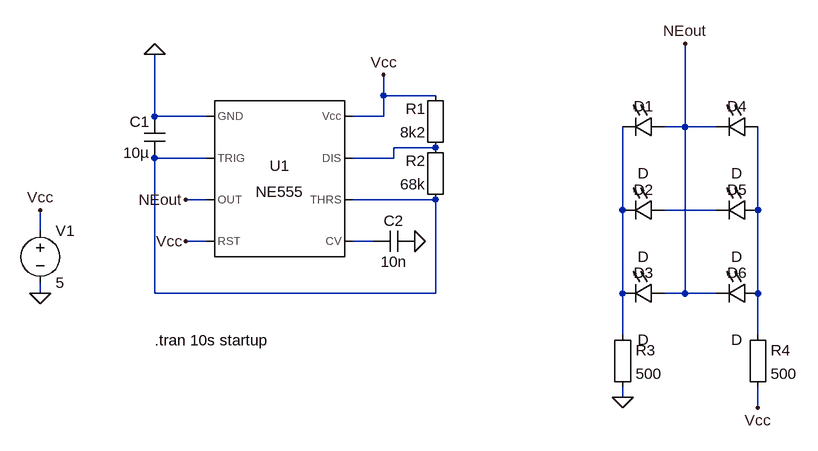
[diagram p0: schematic projekt1.asc]
projekt1.asc, the LTspice schematic file:
Version 4.1
SHEET 1 1160 680
WIRE 464 112 464 80
WIRE 544 112 464 112
WIRE 112 144 112 48
WIRE 192 144 112 144
WIRE 464 144 464 112
WIRE 464 144 416 144
WIRE 928 160 928 32
WIRE 928 160 896 160
WIRE 976 160 928 160
WIRE 544 192 480 192
WIRE 192 208 112 208
WIRE 480 208 480 192
WIRE 480 208 416 208
WIRE 192 272 160 272
WIRE 544 272 416 272
WIRE 832 288 832 160
WIRE 976 288 896 288
WIRE 1040 288 1040 160
WIRE -64 320 -64 288
WIRE 192 336 160 336
WIRE 448 336 416 336
WIRE -64 416 -64 400
WIRE 112 416 112 208
WIRE 544 416 544 272
WIRE 544 416 112 416
WIRE 832 416 832 288
WIRE 928 416 928 160
WIRE 928 416 896 416
WIRE 976 416 928 416
WIRE 1040 416 1040 288
WIRE 832 480 832 416
WIRE 1040 480 1040 416
WIRE 832 576 832 560
WIRE 1040 592 1040 560
FLAG 112 48 0
FLAG -64 416 0
FLAG -64 288 Vcc
FLAG 160 336 Vcc
FLAG 160 272 NEout
FLAG 464 80 Vcc
FLAG 928 32 NEout
FLAG 832 576 0
FLAG 1040 592 Vcc
FLAG 512 336 0
SYMBOL Misc\\NE555 304 240 R0
SYMATTR InstName U1
SYMBOL cap 128 208 R180
WINDOW 0 24 56 Left 2
WINDOW 3 24 8 Left 2
SYMATTR InstName C1
SYMATTR Value 10µ
SYMBOL voltage -64 304 R0
WINDOW 123 0 0 Left 0
WINDOW 39 0 0 Left 0
SYMATTR InstName V1
SYMATTR Value 5
SYMBOL Misc\\EuropeanResistor 560 208 R180
WINDOW 0 31 76 Left 2
WINDOW 3 31 40 Left 2
SYMATTR InstName R1
SYMATTR Value 8k2
SYMATTR SpiceLine tol=100k
SYMBOL Misc\\EuropeanResistor 560 288 R180
WINDOW 0 31 76 Left 2
WINDOW 3 31 40 Left 2
SYMATTR InstName R2
SYMATTR Value 68k
SYMBOL LED 896 144 R90
WINDOW 0 0 32 VBottom 2
WINDOW 3 72 32 VTop 2
SYMATTR InstName D1
SYMBOL LED 896 272 R90
WINDOW 0 0 32 VBottom 2
WINDOW 3 72 32 VTop 2
SYMATTR InstName D2
SYMBOL LED 896 400 R90
WINDOW 0 0 32 VBottom 2
WINDOW 3 72 32 VTop 2
SYMATTR InstName D3
SYMBOL LED 1040 144 R90
WINDOW 0 0 32 VBottom 2
WINDOW 3 72 32 VTop 2
SYMATTR InstName D4
SYMBOL LED 1040 272 R90
WINDOW 0 0 32 VBottom 2
WINDOW 3 72 32 VTop 2
SYMATTR InstName D5
SYMBOL LED 1040 400 R90
WINDOW 0 0 32 VBottom 2
WINDOW 3 72 32 VTop 2
SYMATTR InstName D6
SYMBOL Misc\\EuropeanResistor 816 464 R0
SYMATTR InstName R3
SYMATTR Value 500
SYMBOL Misc\\EuropeanResistor 1024 464 R0
SYMATTR InstName R4
SYMATTR Value 500
SYMBOL cap 512 320 R90
WINDOW 0 0 32 VBottom 2
WINDOW 3 32 32 VTop 2
SYMATTR InstName C2
SYMATTR Value 10n
TEXT 112 488 Left 2 !.tran 10s startup

The netlist it stands for:
* projekt1.asc
X§U1 0 N002 NEout Vcc N006 N002 N001 Vcc NE555  ; pins GND TRIG OUT RST CV THRS DIS Vcc
C1 N002 0 10µ
V1 Vcc 0 5
R1 N001 Vcc 8k2 tol=100k
R2 N002 N001 68k
D1 NEout N003 D
D2 N004 N003 D
D3 NEout N003 D
D4 N005 NEout D
D5 N005 N004 D
D6 N005 NEout D
R3 N003 0 500
R4 N005 Vcc 500
C2 0 N006 10n
.model D D
.lib standard.dio
.tran 10s startup
.lib NE555.sub
.backanno
.end